# EasyEDA Pro project 2399-Digital-Delay-Line.eprj

# Board PCB1
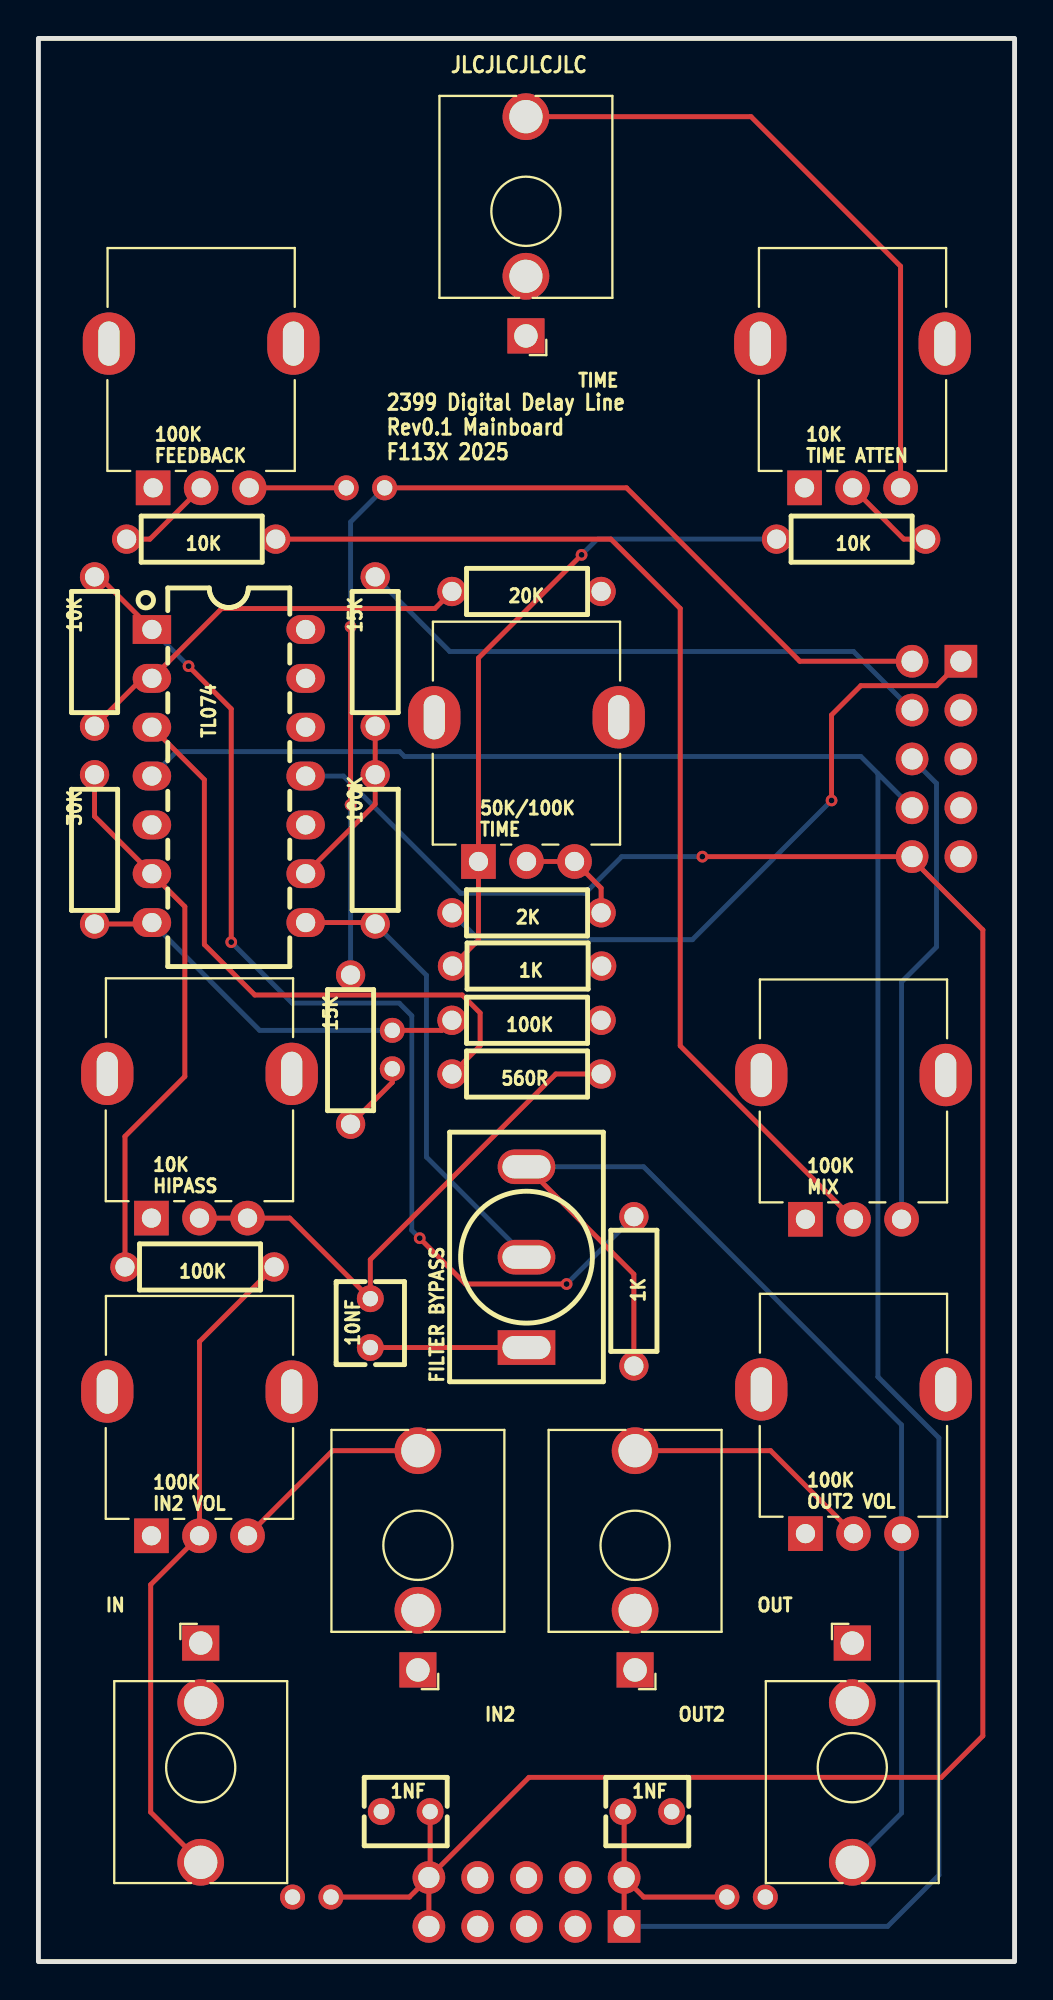
[diagram p0: board, top side]
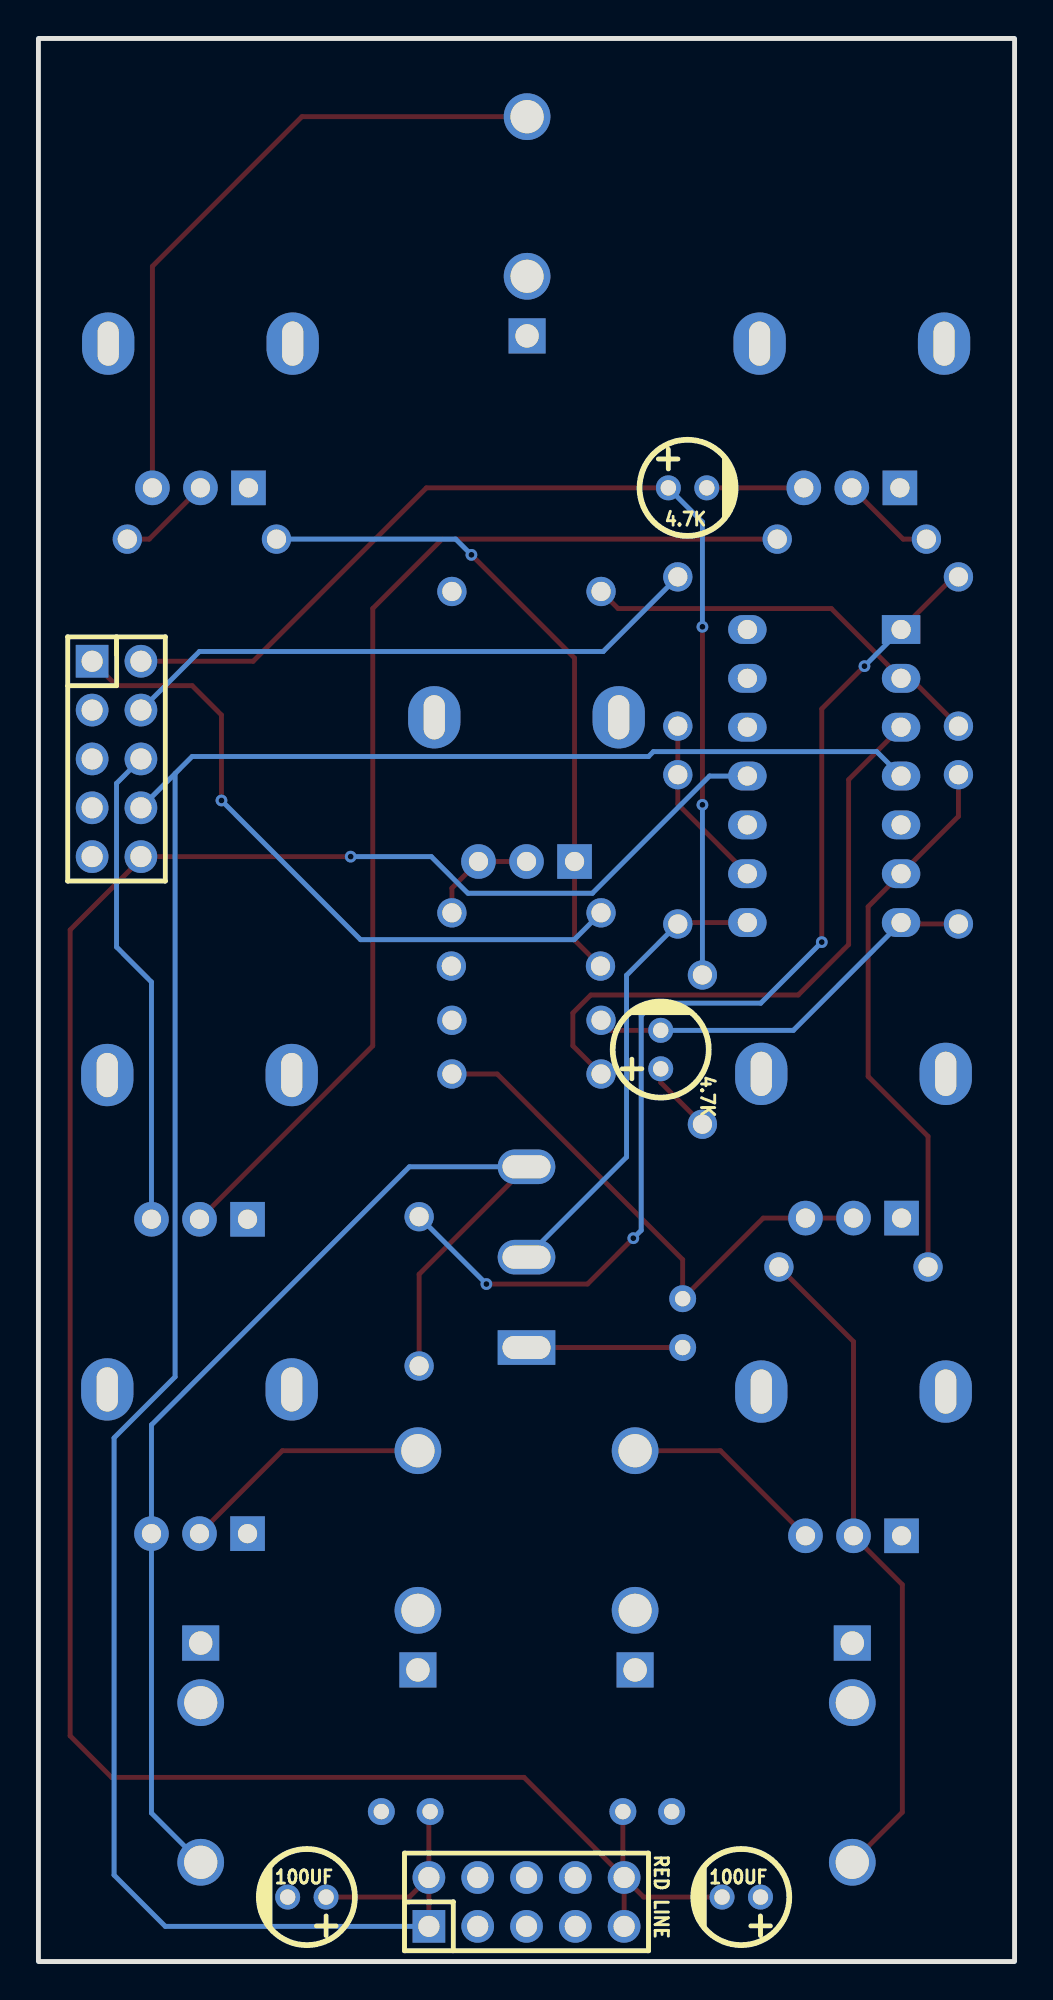
[diagram p1: board, bottom side, seen from below]

Outline 50.8 x 100 mm; copper layers: Top Layer, Bottom Layer. Coordinates in mm from the lower left corner of the outline.
Outline path: rectangle 0,100 50.8,0
Stack: Top Layer 0.035mm / Dielectric1 1.51mm FR4 er 4.5 / Bottom Layer 0.035mm

## Design rules (mm)
template: JLCPCB Capability(Two Layers Board)
spacing copperThickness1oz (default): track to track 0.102, other pairs 0.152 to 0.3
spacing copperThickness2oz: track to track 0.203, other pairs 0.152 to 0.3
track width copperThickness1oz (default): min 0.127, default 0.254, max 2.54
track width copperThickness2oz: min 0.203, default 0.254, max 2.54
differential pair differentialPair (default): width min 0.127, default 0.254, max 2.54; gap min 0.152, default 0.152
via viaSize (default): diameter min 0.5, default 0.61, max 10; hole min 0.3, default 0.305, max 6.3

## Placement (name value [footprint] x y rotation side)
1K  -  [Resistor_Small]  25.43 51.77 0 top
1K#2  -  [Resistor_Small]  30.99 34.85 90 top
1NF  -  [CAP-TH_L4.2-W3.5-P2.54-D0.5]  31.69 7.8 0 top
1NF#2  -  [CAP-TH_L4.2-W3.5-P2.54-D0.5]  19.11 7.8 0 top
2K  -  [Resistor_Small]  25.4 54.53 0 top
4.7K  -  [CAP-TH_BD5.0-P2.00-D0.8-FD]  18.41 47.42 90 bottom
4.7K#2  -  [CAP-TH_BD5.0-P2.00-D0.8-FD]  17.02 76.63 180 bottom
10K  -  [Resistor_Small]  8.47 73.97 0 top
10K
HIPASS  -  [benjiaomodular:Potentiometer_RV09]  5.88 38.66 90 top
10K
TIME ATTEN  -  [benjiaomodular:Potentiometer_RV09]  39.87 76.63 90 top
10K#2  -  [Resistor_Small]  42.29 73.97 0 top
10K#3  -  [Resistor_Small]  2.92 68.12 270 top
10NF  -  [CAP-TH_L4.2-W3.5-P2.54-D0.5]  17.27 33.2 90 top
15K  -  [Resistor_Small]  16.25 47.42 270 top
15K#2  -  [Resistor_Small]  17.53 68.12 270 top
20K  -  [Resistor_Small]  25.4 71.24 0 top
30K  -  [Resistor_Small]  2.92 57.84 270 top
50K/100K
TIME  -  [benjiaomodular:Potentiometer_RV09]  22.9 57.2 90 top
100K  -  [Resistor_Small]  8.38 36.12 0 top
100K
FEEDBACK  -  [benjiaomodular:Potentiometer_RV09]  5.97 76.63 90 top
100K
IN2 VOL  -  [benjiaomodular:Potentiometer_RV09]  5.88 22.14 90 top
100K
MIX  -  [benjiaomodular:Potentiometer_RV09]  39.92 38.6 90 top
100K
OUT2 VOL  -  [benjiaomodular:Potentiometer_RV09]  39.92 22.25 90 top
100K#2  -  [Resistor_Small]  25.4 48.95 0 top
100K#3  -  [Resistor_Small]  17.53 57.84 270 top
100UF  -  [CAP-TH_BD5.0-P2.00-D0.8-FD]  36.83 3.35 0 bottom
100UF#2  -  [CAP-TH_BD5.0-P2.00-D0.8-FD]  14.22 3.35 0 bottom
560R  -  [Resistor_Small]  25.4 46.15 0 top
FILTER BYPASS  -  [SW-TH_MT-0-103-A101-M200-RS]  25.4 36.63 90 top
IN  -  [benjiaomodular:AudioJack_3.5mm]  8.45 16.56 0 top
IN2  -  [benjiaomodular:AudioJack_3.5mm]  19.75 15.16 180 top
OUT  -  [benjiaomodular:AudioJack_3.5mm]  42.35 16.56 0 top
OUT2  -  [benjiaomodular:AudioJack_3.5mm]  31.05 15.16 180 top
RED LINE  -  [HDR-TH_10P-P2.54-V-M-R2-C5-S2.54]  25.4 3.1 180 bottom
RED LINE#2  -  [HDR-TH_10P-P2.54-V-M-R2-C5-S2.54]  46.74 62.53 270 bottom
TIME   -  [benjiaomodular:AudioJack_3.5mm]  25.37 84.53 180 top
TL074  -  [PDIP-14_L19.7-W6.6-P2.54-LS8.3-BL]  9.91 61.65 270 top

## Footprints (pads in the part's own frame, mm; a bottom-side part is the same pattern mirrored in y, then rotated)
benjiaomodular:AudioJack_3.5mm
  rect 1.93x1.83 hole 1.22: S(0,0)
  round 2.43 hole 1.73: T(0,-11.4)
  round 2.43 hole 1.72: TN(0,-3.1)
benjiaomodular:Potentiometer_RV09
  rect 1.8x1.8 hole 1: 1(0,0)
  round 1.8 hole 1: 2(0,-2.5) 3(0,-5)
  oval 3.24x2.72 hole 2.3x1.1: 4(7.5,-7.3) 5(7.5,2.3)
CAP-TH_BD5.0-P2.00-D0.8-FD
  round 1.3 hole 0.8: 1(-1,0) 2(1,0)
CAP-TH_L4.2-W3.5-P2.54-D0.5
  round 1.4 hole 0.8: 1(-1.27,0) 2(1.27,0)
HDR-TH_10P-P2.54-V-M-R2-C5-S2.54
  rect 1.7x1.7 hole 1.1: 1(-5.08,-1.27)
  round 1.7 hole 1.1: 2(-5.08,1.27) 3(-2.54,-1.27) 4(-2.54,1.27) 5(0,-1.27) 6(0,1.27) 7(2.54,-1.27) 8(2.54,1.27) 9(5.08,-1.27) 10(5.08,1.27)
PDIP-14_L19.7-W6.6-P2.54-LS8.3-BL
  rect 1.5x2 hole 1: 1(-7.62,-4)
  oval 1.5x2 hole 1: 2(-5.08,-4) 3(-2.54,-4) 4(0,-4) 5(2.54,-4) 6(5.08,-4) 7(7.62,-4) 8(7.62,4) 9(5.08,4) 10(2.54,4) 11(0,4) 12(-2.54,4) 13(-5.08,4) 14(-7.62,4)
Resistor_Small
  round 1.524 hole 1: 1(-3.88,0) 2(3.882,0)
SW-TH_MT-0-103-A101-M200-RS
  rect 1.8x3 hole 1.2x2.5: 1(-4.7,0)
  oval 1.8x3 hole 1.2x2.5: 2(0,0) 3(4.7,0)

## Nets
GND: 1K.2 1NF.2 1NF#2.1 10K
HIPASS.1 10K
TIME ATTEN.1 20K.2 100K
IN2 VOL.1 100K
MIX.1 100K
OUT2 VOL.1 100K#2.2 100UF.2 100UF#2.1 IN.S IN2.S OUT.S OUT2.S RED LINE.3 RED LINE.4 RED LINE.5 RED LINE.6 RED LINE.7 RED LINE.8 RED LINE#2.3 RED LINE#2.5 RED LINE#2.7 RED LINE#2.9 TIME .S TL074.5 TL074.10
2399P6: 2K.1 RED LINE#2.1
+12: 1NF.1 100UF.1 RED LINE.1 RED LINE.2 RED LINE#2.8 TL074.4
-12: 1NF#2.2 100UF#2.2 RED LINE.9 RED LINE.10 RED LINE#2.10 TL074.11
A: 4.7K#2.1 15K.1 RED LINE#2.2
B: 15K#2.1 RED LINE#2.4
FILTER_IN: 10NF.1 FILTER BYPASS.1
IN2: 100K
IN2 VOL.3 IN2.T
INS: 100K.2 100K
IN2 VOL.2 IN.T
MIX: 100K
MIX.3 RED LINE#2.6
OUT: 100K#3.2 FILTER BYPASS.2 TL074.8
OUT2: 100K
OUT2 VOL.2 OUT2.T
OUTS: 1K#2.1 100K
OUT2 VOL.3 FILTER BYPASS.3 OUT.T

Pads without a net: 1K 1; 1K#2 2; 2K 2; 4.7K 1 2; 4.7K#2 2; 10K 1 2; 10K
HIPASS 2 3 4 5; 10K
TIME ATTEN 2 3 4 5; 10K#2 1 2; 10K#3 1 2; 10NF 2; 15K 2; 15K#2 2; 20K 1; 30K 1 2; 50K/100K
TIME 1 2 3 4 5; 100K 1; 100K
FEEDBACK 1 2 3 4 5; 100K
IN2 VOL 4 5; 100K
MIX 2 4 5; 100K
OUT2 VOL 4 5; 100K#2 1; 100K#3 1; 560R 1 2; IN TN; IN2 TN; OUT TN; OUT2 TN; TIME  T TN; TL074 1 2 3 6 7 9 12 13 14

## Via types
v1: diameter 0.61, hole 0.305, Top Layer to Bottom Layer, 9 vias

## Routing (per net, layer and track width the routed paths; a pad name or vN(x,y) marks a point on that pad's centre or on a via; arc(x,y) is an arc through that point)
(no net): length 351.2
  Top Layer w0.254: v1(28.27,73.15) 22.9,67.78 50K/100K
TIME.1 22.9,53.12 21.55,51.77 ; TL074.7 5.83,53.95 30K.2 ; 30K.1 2.92,59.55 TL074.6 7.62,54.85 7.62,46.03 4.5,42.91 100K.1 ; 16.25,43.54 18.41,45.71 4.7K.1 ; TL074.9 17.53,60.19 100K#3.1 15K#2.2 ; v1(10.03,53.01) 10.03,65.14 v1(7.81,67.36) ; 20K.1 20.63,70.36 9.53,70.36 TL074.2 5.41,66.73 10K#3.2 ; 560R.2 26.92,46.15 17.27,36.5 10NF.2 13.08,38.66 10K
HIPASS.3 10K
HIPASS.2 ; v1(19.84,37.61) 22.22,35.23 v1(27.49,35.23) ; TIME .T 37.09,95.93 44.87,88.15 10K
TIME ATTEN.3 ; 10K
TIME ATTEN.2 45.04,73.97 10K#2.2 ; TL074.3 8.64,61.46 8.64,52.88 11.26,50.26 22.05,50.26 22.99,49.33 22.99,47.62 560R.1 ; 10K#3.1 3.17,72 TL074.1 ; 100K
MIX.2 33.4,47.61 33.4,70.36 29.79,73.97 10K.2 ; 100K
FEEDBACK.2 5.8,73.97 10K.1 ; 100K
FEEDBACK.3 4.7K#2.2 ; 100K#2.1 21,48.42 4.7K.2 ; 2K.2 29.28,55.82 50K/100K
TIME.3 50K/100K
TIME.2
  Bottom Layer w0.254: TL074.7 11.51,48.42 4.7K.2 ; v1(27.49,35.23) 1K#2.2 ; TL074.1 v1(7.81,67.36) ; v1(19.84,37.61) 19.43,38.02 19.43,49.18 18.78,49.83 13.21,49.83 v1(10.03,53.01) ; v1(28.27,73.15) 29.08,73.97 10K#2.1
2399P6: length 35.7
  Top Layer w0.254: v1(41.28,60.38) 41.28,64.82 42.8,66.34 46.74,66.34 RED LINE#2.1
  Bottom Layer w0.254: 2K.1 22.92,53.14 34.04,53.14 v1(41.28,60.38)
+12: length 129.1
  Top Layer w0.254: RED LINE.2 31.5,3.35 100UF.1 ; RED LINE.2 30.48,7.73 1NF.1 ; RED LINE.2 RED LINE.1
  Bottom Layer w0.254: TL074.4 7.18,62.92 18.8,62.92 19.05,62.66 42.8,62.66 43.69,61.77 ; RED LINE.1 44.2,1.83 46.86,4.5 46.86,27.23 43.69,30.4 43.69,61.77 ; 43.69,61.77 45.47,60
-12: length 125.4
  Top Layer w0.254: RED LINE.10 19.3,3.35 100UF#2.2 ; RED LINE.10 20.38,4.43 ; RED LINE.10 RED LINE.9 ; 20.38,4.43 1NF#2.2 ; 20.38,4.43 25.53,9.58 46.99,9.58 49.15,11.74 49.15,53.64 45.47,57.33 RED LINE#2.10 v1(34.55,57.45)
  Bottom Layer w0.254: v1(34.55,57.45) 30.35,57.45 28.45,55.55 21.97,55.55 15.88,61.65 TL074.11
A: length 57.2
  Top Layer w0.254: v1(16.25,69.41) v1(16.25,60.15) ; 4.7K#2.1 30.61,76.63 39.62,67.61 RED LINE#2.2
  Bottom Layer w0.254: v1(16.25,60.15) 15K.1 ; 4.7K#2.1 16.25,74.86 v1(16.25,69.41)
B: length 30.8
  Bottom Layer w0.254: RED LINE#2.4 42.42,68.12 21.41,68.12 15K#2.1
FILTER_IN: length 8.1
  Top Layer w0.254: 10NF.1 25.4,31.93
IN2: length 10.7
  Top Layer w0.254: IN2.T 15.31,26.56 100K
IN2 VOL.3
INS: length 34.7
  Top Layer w0.254: 100K.2 8.38,32.24 100K
IN2 VOL.2 5.84,19.6 5.84,7.76 IN.T
MIX: length 25.2
  Bottom Layer w0.254: RED LINE#2.6 46.74,61.27 46.74,52.76 44.92,50.94 100K
MIX.3
OUT: length 24.2
  Top Layer w0.254: TL074.8 17.45,54.03 100K#3.2
  Bottom Layer w0.254: 100K#3.2 20.19,51.29 20.19,41.83 FILTER BYPASS.2
OUT2: length 13.2
  Top Layer w0.254: OUT2.T 38.1,26.56 100K
OUT2 VOL.2
OUTS: length 61.6
  Top Layer w0.254: 1K#2.1 30.99,35.74 FILTER BYPASS.3
  Bottom Layer w0.254: OUT.T 44.92,7.72 100K
OUT2 VOL.3 44.92,27.9 31.5,41.33 FILTER BYPASS.3

## Copper pours and planes (outline as drawn; the poured copper is in the pictures)
GND on Top Layer: 0,100 50.8,100 50.8,0 0,0
GND on Bottom Layer: 0,100 50.8,100 50.8,0 0,0

## Text on the board
Top Silkscreen Layer: 2399 Digital Delay Line / Rev0.1 Mainboard / F113X 2025 | JLCJLCJLCJLC

# Board PCB2
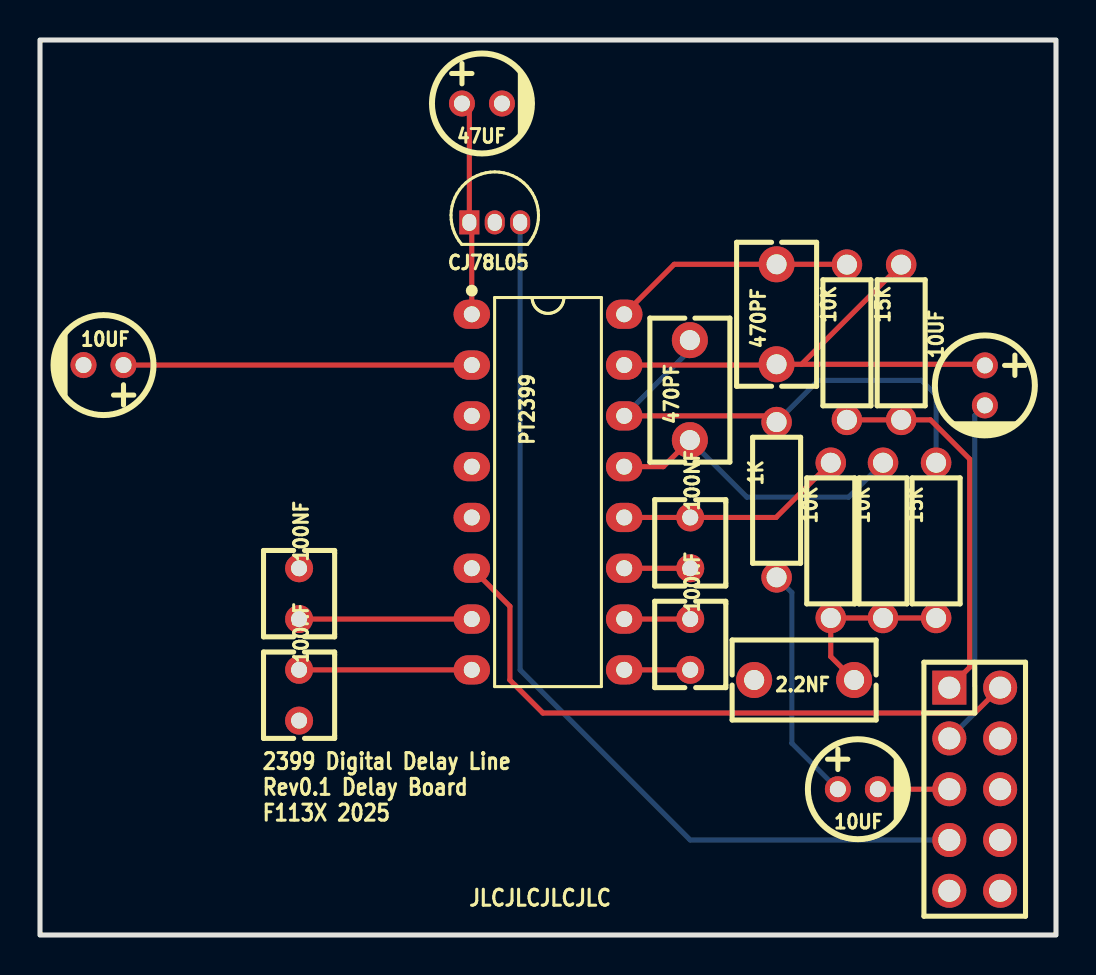
[diagram p2: board, top side]
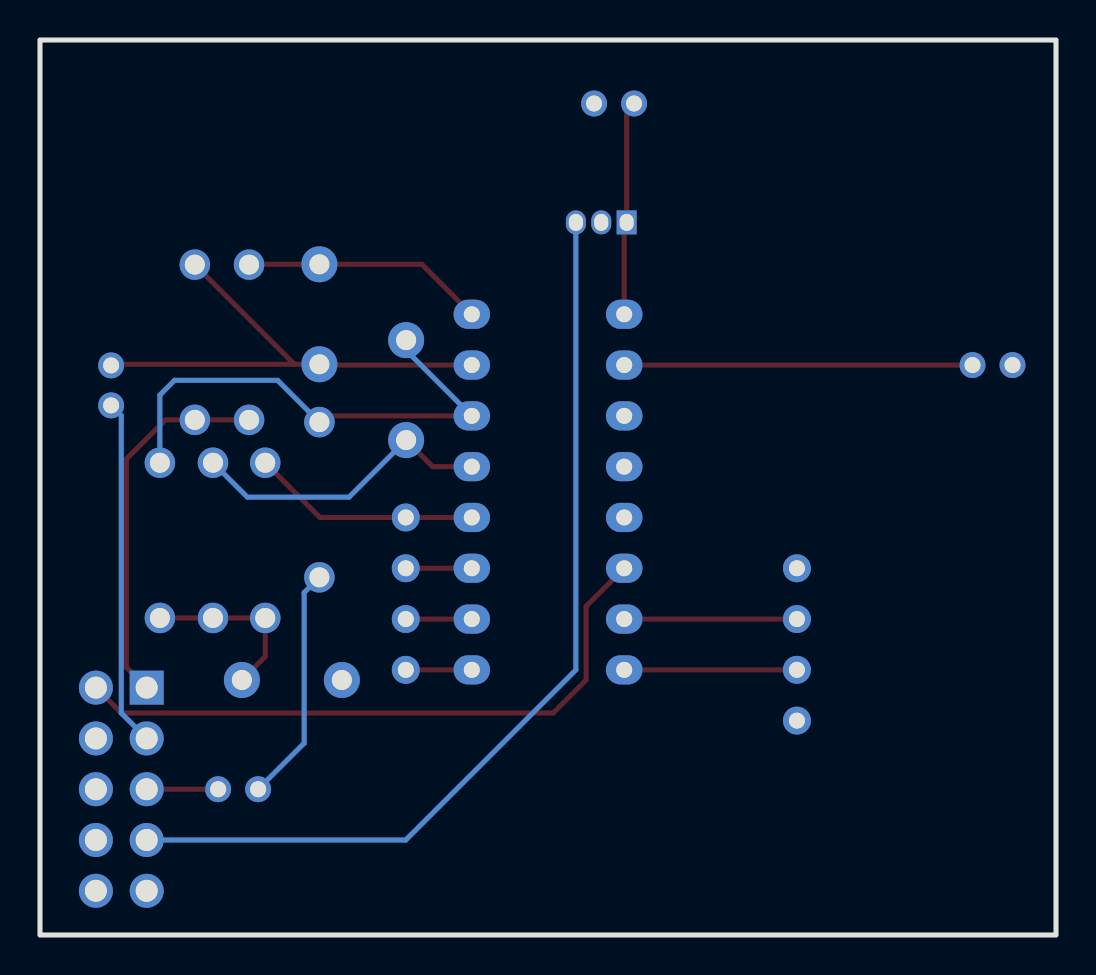
[diagram p3: board, bottom side, seen from below]

Outline 50.8 x 44.75 mm; copper layers: Top Layer, Bottom Layer. Coordinates in mm from the lower left corner of the outline.
Outline path: rectangle 0,44.75 50.8,0
Stack: Top Layer 0.035mm / Dielectric1 1.51mm FR4 er 4.5 / Bottom Layer 0.035mm

## Design rules (mm)
template: JLCPCB Capability(Two Layers Board)
spacing copperThickness1oz (default): track to track 0.102, other pairs 0.152 to 0.3
spacing copperThickness2oz: track to track 0.203, other pairs 0.152 to 0.3
track width copperThickness1oz (default): min 0.127, default 0.254, max 2.54
track width copperThickness2oz: min 0.203, default 0.254, max 2.54
differential pair differentialPair (default): width min 0.127, default 0.254, max 2.54; gap min 0.152, default 0.152
via viaSize (default): diameter min 0.5, default 0.61, max 10; hole min 0.3, default 0.305, max 6.3

## Placement (name value [footprint] x y rotation side)
1K  -  [Resistor_Small]  36.83 21.77 270 top
2.2NF  -  [CAP-TH_L7.2-W4.0-P5.00-D0.5]  38.21 12.75 0 top
10K  -  [Resistor_Small]  40.35 29.64 270 top
10K#2  -  [Resistor_Small]  42.15 19.74 270 top
10K#3  -  [Resistor_Small]  39.54 19.74 270 top
10UF  -  [CAP-TH_BD5.0-P2.00-D0.8-FD]  3.17 28.5 180 top
10UF#2  -  [CAP-TH_BD5.0-P2.00-D0.8-FD]  47.24 27.48 270 top
10UF#3  -  [CAP-TH_BD5.0-P2.00-D0.8-FD]  40.89 7.29 0 top
15K  -  [Resistor_Small]  43.06 29.64 270 top
15K#2  -  [Resistor_Small]  44.81 19.74 270 top
47UF  -  [CAP-TH_BD5.0-P2.00-D0.8-FD]  22.1 41.58 0 top
100NF  -  [CAP-TH_L4.2-W3.5-P2.54-D0.5]  32.51 14.53 270 top
100NF#2  -  [CAP-TH_L4.2-W3.5-P2.54-D0.5]  32.51 19.61 270 top
100NF#3  -  [CAP-TH_L4.2-W3.5-P2.54-D0.5]  12.95 11.99 270 top
100NF#4  -  [CAP-TH_L4.2-W3.5-P2.54-D0.5]  12.95 17.07 270 top
470PF  -  [CAP-TH_L7.2-W4.0-P5.00-D0.5]  32.49 27.25 90 top
470PF#2  -  [CAP-TH_L7.2-W4.0-P5.00-D0.5]  36.83 31.04 90 top
CJ78L05  -  [TO-92-3_L4.5-W3.5-P1.27-L]  22.74 35.63 0 top
PT2399  -  [DIP-16_L19.3-W6.4-P2.54-LS7.6-BL]  25.4 22.15 270 top
RED LINE  -  [HDR-TH_10P-P2.54-V-M-R2-C5-S2.54]  46.74 7.29 270 top

## Footprints (pads in the part's own frame, mm; a bottom-side part is the same pattern mirrored in y, then rotated)
CAP-TH_BD5.0-P2.00-D0.8-FD
  round 1.3 hole 0.8: 1(-1,0) 2(1,0)
CAP-TH_L4.2-W3.5-P2.54-D0.5
  round 1.4 hole 0.8: 1(-1.27,0) 2(1.27,0)
CAP-TH_L7.2-W4.0-P5.00-D0.5
  round 1.8 hole 1: 1(-2.499,0) 2(2.499,0)
DIP-16_L19.3-W6.4-P2.54-LS7.6-BL
  oval 1.46x1.825 hole 0.8: 1(-8.89,-3.81) 2(-6.35,-3.81) 3(-3.81,-3.81) 4(-1.27,-3.81) 5(1.27,-3.81) 6(3.81,-3.81) 7(6.35,-3.81) 8(8.89,-3.81) 9(8.89,3.81) 10(6.35,3.81) 11(3.81,3.81) 12(1.27,3.81) 13(-1.27,3.81) 14(-3.81,3.81) 15(-6.35,3.81) 16(-8.89,3.81)
HDR-TH_10P-P2.54-V-M-R2-C5-S2.54
  rect 1.7x1.7 hole 1.1: 1(-5.08,-1.27)
  round 1.7 hole 1.1: 2(-5.08,1.27) 3(-2.54,-1.27) 4(-2.54,1.27) 5(0,-1.27) 6(0,1.27) 7(2.54,-1.27) 8(2.54,1.27) 9(5.08,-1.27) 10(5.08,1.27)
Resistor_Small
  round 1.524 hole 1: 1(-3.88,0) 2(3.882,0)
TO-92-3_L4.5-W3.5-P1.27-L
  rect 1x1.2 hole 0.7x0.85: 1(-1.27,0)
  oval 1x1.2 hole 0.7x0.85: 2(0,0) 3(1.27,0)

## Nets
GND: 2.2NF.1 10UF.2 47UF.2 100NF#3.2 100NF#4.1 CJ78L05.2 PT2399.3 PT2399.4 RED LINE.4 RED LINE.6 RED LINE.8 RED LINE.10
2399P2: 10UF.1 PT2399.2
2399P6: PT2399.6 RED LINE.2
2399P12: 10K#3.1 100NF#2.1 PT2399.12
2399P13: 10K#2.1 470PF.1 PT2399.13
2399P14: 1K.1 15K#2.1 470PF.2 PT2399.14
2399P15: 10UF#2.1 15K.1 470PF#2.1 PT2399.15
2399P16: 10K.1 470PF#2.2 PT2399.16
+5: 47UF.1 CJ78L05.1 PT2399.1
+12: CJ78L05.3 RED LINE.7
-12: RED LINE.9
A: 10K.2 15K.2 RED LINE.1
B: 10UF#2.2 RED LINE.3
MIX: 10UF#3.2 RED LINE.5

Pads without a net: 1K 2; 2.2NF 2; 10K#2 2; 10K#3 2; 10UF#3 1; 15K#2 2; 100NF 1 2; 100NF#2 2; 100NF#3 1; 100NF#4 2; PT2399 5 7 8 9 10 11

## Routing (per net, layer and track width the routed paths; a pad name or vN(x,y) marks a point on that pad's centre or on a via; arc(x,y) is an arc through that point)
(no net): length 47.9
  Top Layer w0.254: 100NF#4.2 PT2399.7 ; 15K#2.2 10K#2.2 10K#3.2 39.54,13.92 2.2NF.2 ; 100NF#3.1 12.96,13.26 PT2399.8 ; PT2399.9 100NF.2 ; PT2399.10 100NF.1 ; PT2399.11 100NF#2.2
  Bottom Layer w0.254: 10UF#3.1 37.59,9.59 37.59,17.12 1K.2
2399P2: length 17.4
  Top Layer w0.254: 10UF.1 PT2399.2
2399P6: length 32.1
  Top Layer w0.254: RED LINE.2 46.74,11.1 25.15,11.1 23.5,12.75 23.5,16.43 PT2399.6
2399P12: length 11.5
  Top Layer w0.254: 10K#3.1 36.8,20.88 100NF#2.1 PT2399.12
2399P13: length 15.4
  Top Layer w0.254: PT2399.13 31.16,23.42 32.49,24.75
  Bottom Layer w0.254: 32.49,24.75 35.35,21.89 40.43,21.89 10K#2.1
2399P14: length 25.4
  Top Layer w0.254: PT2399.14 36.52,25.96 1K.1
  Bottom Layer w0.254: 1K.1 38.92,27.74 44.07,27.74 44.81,27 15K#2.1 ; 470PF.2 32.49,29.24 PT2399.14
2399P15: length 25.1
  Top Layer w0.254: 38.08,28.54 470PF#2.1 36.79,28.5 PT2399.15 ; 38.08,28.54 47.19,28.54 10UF#2.1 ; 38.08,28.54 15K.1
2399P16: length 12.2
  Top Layer w0.254: PT2399.16 31.71,33.54 470PF#2.2 40.33,33.54 10K.1
+5: length 10.7
  Top Layer w0.254: PT2399.1 21.59,35.51 CJ78L05.1 21.47,41.21 47UF.1
+12: length 47.4
  Bottom Layer w0.254: CJ78L05.3 24.01,13.25 32.51,4.75 45.47,4.75
A: length 18.8
  Top Layer w0.254: 10K.2 15K.2 44.52,25.76 46.48,23.8 46.48,13.39 RED LINE.1
B: length 17.4
  Bottom Layer w0.254: 10UF#2.2 46.74,25.97 46.74,11.1 RED LINE.3
MIX: length 3.6
  Top Layer w0.254: 10UF#3.2 RED LINE.5

## Copper pours and planes (outline as drawn; the poured copper is in the pictures)
GND on Top Layer: 0,44.75 50.8,44.75 50.8,0 0,0
GND on Bottom Layer: 0,44.75 50.8,44.75 50.8,0 0,0

## Text on the board
Top Silkscreen Layer: 2399 Digital Delay Line / Rev0.1 Delay Board / F113X 2025 | JLCJLCJLCJLC

# Board PCB3
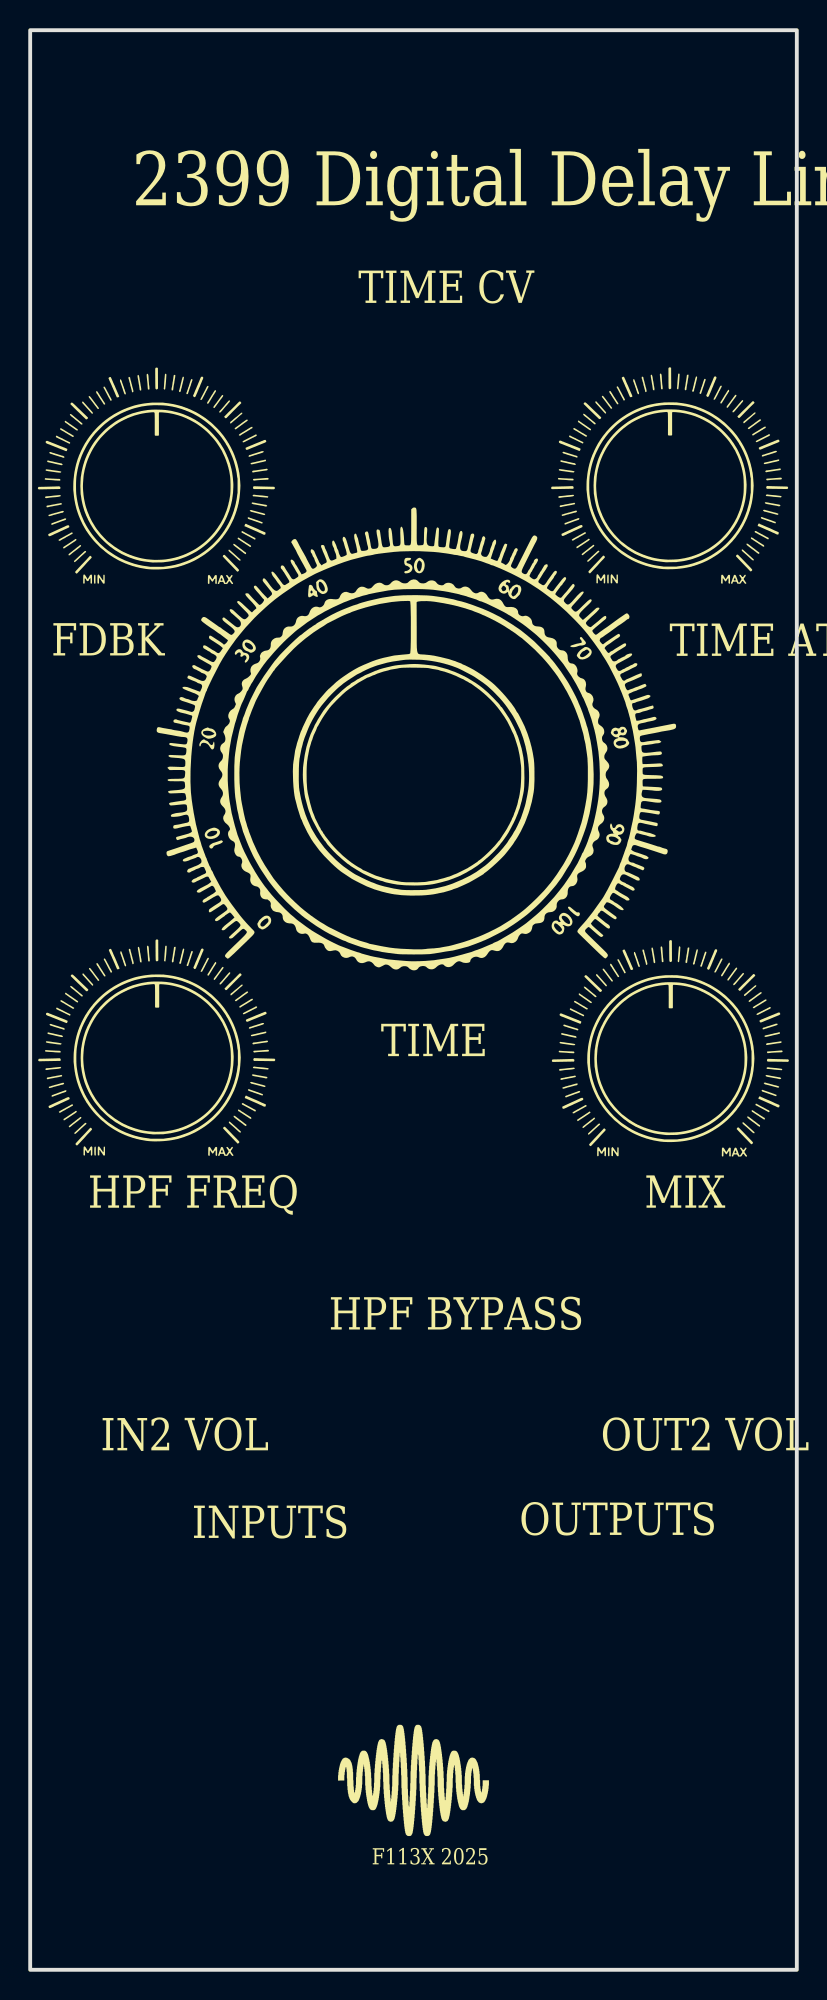
[diagram p4: board, top side]
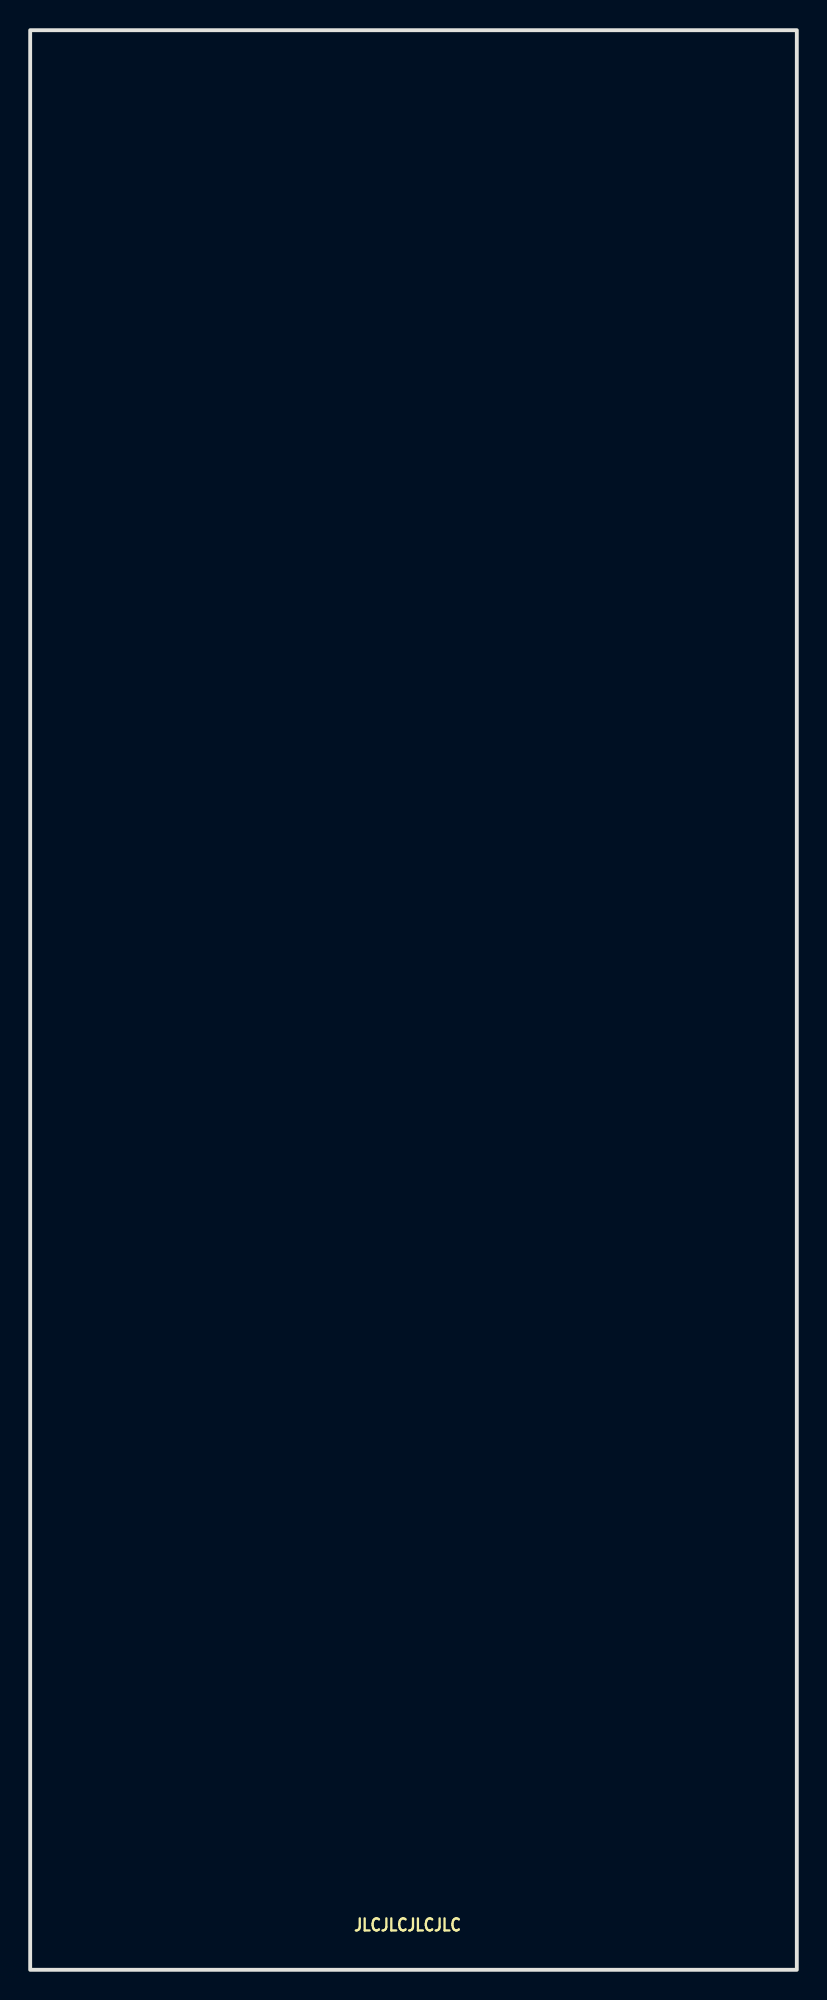
[diagram p5: board, bottom side, seen from below]

Outline 50.8 x 128.5 mm; copper layers: Top Layer, Bottom Layer. Coordinates in mm from the lower left corner of the outline.
Outline path: rectangle 0,128.5 50.8,0
Stack: Top Layer 0.035mm / Dielectric1 1.51mm FR4 er 4.5 / Bottom Layer 0.035mm

## Design rules (mm)
template: JLCPCB Capability(Two Layers Board)
spacing copperThickness1oz (default): track to track 0.102, other pairs 0.152 to 0.3
spacing copperThickness2oz: track to track 0.203, other pairs 0.152 to 0.3
track width copperThickness1oz (default): min 0.127, default 0.254, max 2.54
track width copperThickness2oz: min 0.203, default 0.254, max 2.54
differential pair differentialPair (default): width min 0.127, default 0.254, max 2.54; gap min 0.152, default 0.152
via viaSize (default): diameter min 0.5, default 0.61, max 10; hole min 0.3, default 0.305, max 6.3

## Placement (name value [footprint] x y rotation side)

## Nets

## Text on the board
Bottom Silkscreen Layer: JLCJLCJLCJLC
Top Silkscreen Layer: F113X 2025 | TIME | FDBK | HPF FREQ | IN2 VOL | INPUTS | HPF BYPASS | TIME CV | OUTPUTS | OUT2 VOL | MIX | TIME ATT | 2399 Digital Delay Line
